# Altium schematic sheet CAp_STM.SchDoc
size A3; Author: Audran; CompanyName: Goldorak; Address1: Electrolab; Address2: 52 rue Paul Lescop; Address3: 92000 Nanterre; ProjectName: Cartes_2017
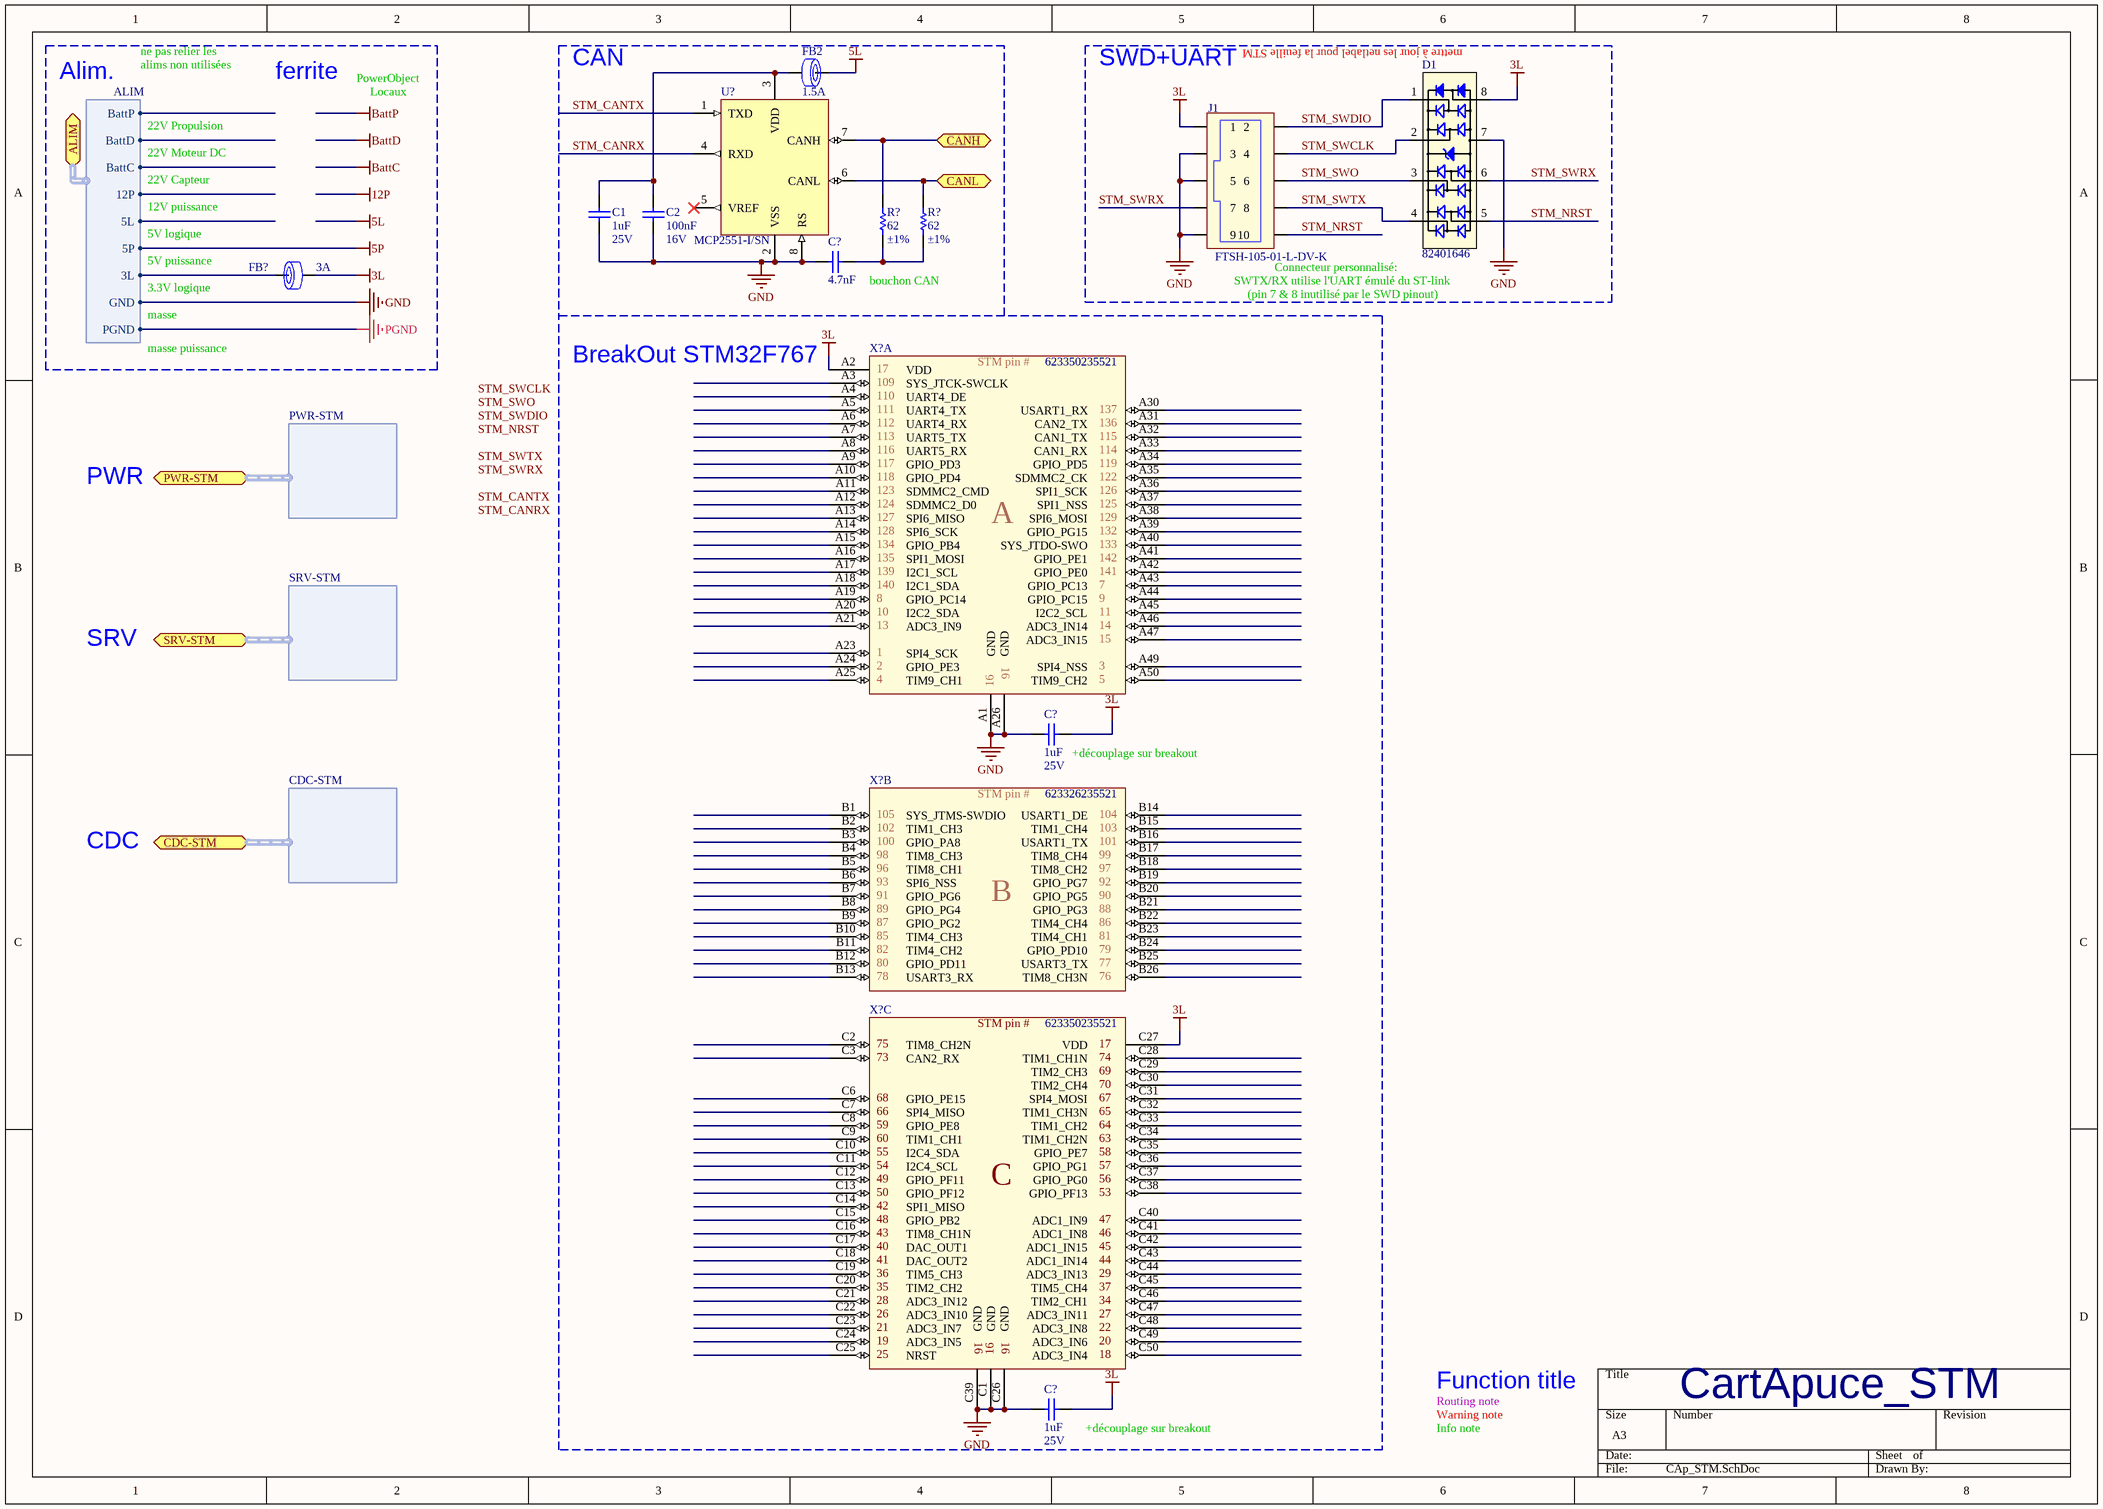
[diagram p0: CAp_STM.SchDoc]

## Parts
(Parts that share a designator on the sheet are numbered #1, #2 ... from top to bottom, then left to right.)
C1  1uF  RatedVoltage: 25V  [WCAP-CSGP_0603, 1.6x0.8x0.8]
C2  100nF  RatedVoltage: 16V  [WCAP-CSGP_0402, 1x0.5x0.5]
C?#1  4.7nF  [WCAP-CSGP_0402, 1x0.5x0.5]
C?#2  1uF  RatedVoltage: 25V  [WCAP-CSGP_0603, 1.6x0.8x0.8]
C?#3  1uF  RatedVoltage: 25V  [WCAP-CSGP_0603, 1.6x0.8x0.8]
D1  82401646  [MSOP-8L]
FB2  RatedCurrent: 1.5A  [WE-CBF_0603_High Current]  (hidden comment: 742792624)
FB?  RatedCurrent: 3A  [WE-CBF_0805_High Current]  (hidden comment: 742792023)
J1  FTSH-105-01-L-DV-K  [FTSH-105-01-L-DV-K]
R?#1  value 62  Precision: ±1%  [RESC1005X04N]  (hidden comment: RC0402FR-0762RL)
R?#2  value 62  Precision: ±1%  [RESC1005X04N]  (hidden comment: RC0402FR-0762RL)
U?  MCP2551-I/SN  [SO8_N]
X?#1  623326235521+2x 623350235521  (value not drawn)  (part A of 3)
X?#2  623326235521+2x 623350235521  (value not drawn)  (part B of 3)
X?#3  623326235521+2x 623350235521  (value not drawn)  (part C of 3)

## Blocks framed on the sheet
CAN: C1 C2 C?#1 FB2 R?#1 R?#2 U?
SWD+UART: D1 J1
BreakOut STM32F767: C?#2 C?#3 X?#1-X?#3

## Ports
ALIM (harness ALIM), CANH, CANL, CDC-STM (harness CDC-STM), PWR-STM (harness PWR-STM), SRV-STM (harness SRV-STM)

## Harnesses
PWR-STM: 
SRV-STM: 
CDC-STM: 
ALIM: BattP, BattD, BattC, 12P, 5L, 5P, 3L, GND, PGND

## Nets
3L: C?#2.1 C?#3.1 D1.8 FB?.2 J1.1 X?#1.A2(VDD) X?#3.C27(VDD)
5L: FB2.1
5P: port ALIM.5P
GND: C1.1 C2.1 C?#1.1 C?#2.2 C?#3.2 D1.7 J1.3 J1.5 J1.9 U?.2(VSS) U?.8(RS) X?#1.A1(GND) X?#1.A26(GND) X?#3.C1(GND) X?#3.C26(GND) X?#3.C39(GND) ; port ALIM.GND
PGND: port ALIM.PGND
CANH: R?#1.2 U?.7(CANH) ; port CANH
CANL: R?#2.2 U?.6(CANL) ; port CANL
STM_CANRX: U?.4(RXD)
STM_CANTX: U?.1(TXD)
STM_NRST: D1.5 J1.10
STM_SWCLK: D1.2 J1.4
STM_SWDIO: D1.1 J1.2
STM_SWO: D1.3 J1.6
STM_SWRX: D1.6 J1.7
STM_SWTX: D1.4 J1.8
NetC1_2: C1.2 C2.2 FB2.2 U?.3(VDD)
NetC?#1_2: C?#1.2 R?#1.1 R?#2.1
NetFB?_1: FB?.1 ; port ALIM.3L

Not connected (* = marked no-connect by the designer): U? 5(VREF)*; X?#1 A3(SYS_JTCK-SWCLK) A4(UART4_DE) A5(UART4_TX) A6(UART4_RX) A7(UART5_TX) A8(UART5_RX) A9(GPIO_PD3) A10(GPIO_PD4) A11(SDMMC2_CMD) A12(SDMMC2_D0) A13(SPI6_MISO) A14(SPI6_SCK) A15(GPIO_PB4) A16(SPI1_MOSI) A17(I2C1_SCL) A18(I2C1_SDA) A19(GPIO_PC14) A20(I2C2_SDA) A21(ADC3_IN9) A22(NC) A23(SPI4_SCK) A24(GPIO_PE3) A25(TIM9_CH1) A27(NC) A28(NC) A29(NC) A30(USART1_RX) A31(CAN2_TX) A32(CAN1_TX) A33(CAN1_RX) A34(GPIO_PD5) A35(SDMMC2_CK) A36(SPI1_SCK) A37(SPI1_NSS) A38(SPI6_MOSI) A39(GPIO_PG15) A40(SYS_JTDO-SWO) A41(GPIO_PE1) A42(GPIO_PE0) A43(GPIO_PC13) A44(GPIO_PC15) A45(I2C2_SCL) A46(ADC3_IN14) A47(ADC3_IN15) A48(NC) A49(SPI4_NSS) A50(TIM9_CH2); X?#2 B1(SYS_JTMS-SWDIO) B2(TIM1_CH3) B3(GPIO_PA8) B4(TIM8_CH3) B5(TIM8_CH1) B6(SPI6_NSS) B7(GPIO_PG6) B8(GPIO_PG4) B9(GPIO_PG2) B10(TIM4_CH3) B11(TIM4_CH2) B12(GPIO_PD11) B13(USART3_RX) B14(USART1_DE) B15(TIM1_CH4) B16(USART1_TX) B17(TIM8_CH4) B18(TIM8_CH2) B19(GPIO_PG7) B20(GPIO_PG5) B21(GPIO_PG3) B22(TIM4_CH4) B23(TIM4_CH1) B24(GPIO_PD10) B25(USART3_TX) B26(TIM8_CH3N); X?#3 C2(TIM8_CH2N) C3(CAN2_RX) C4(NC) C5(NC) C6(GPIO_PE15) C7(SPI4_MISO) C8(GPIO_PE8) C9(TIM1_CH1) C10(I2C4_SDA) C11(I2C4_SCL) C12(GPIO_PF11) C13(GPIO_PF12) C14(SPI1_MISO) C15(GPIO_PB2) C16(TIM8_CH1N) C17(DAC_OUT1) C18(DAC_OUT2) C19(TIM5_CH3) C20(TIM2_CH2) C21(ADC3_IN12) C22(ADC3_IN10) C23(ADC3_IN7) C24(ADC3_IN5) C25(NRST) C28(TIM1_CH1N) C29(TIM2_CH3) C30(TIM2_CH4) C31(SPI4_MOSI) C32(TIM1_CH3N) C33(TIM1_CH2) C34(TIM1_CH2N) C35(GPIO_PE7) C36(GPIO_PG1) C37(GPIO_PG0) C38(GPIO_PF13) C40(ADC1_IN9) C41(ADC1_IN8) C42(ADC1_IN15) C43(ADC1_IN14) C44(ADC3_IN13) C45(TIM5_CH4) C46(TIM2_CH1) C47(ADC3_IN11) C48(ADC3_IN8) C49(ADC3_IN6) C50(ADC3_IN4)

## Notes on the sheet
- (near D1) mettre à jour les netlabel pour la feuille STM
- Alim.
- ne pas relier les
- alims non utilisées
- ferrite
- PowerObject
- Locaux
- 22V Propulsion
- 22V Moteur DC
- 22V Capteur
- 5V logique
- 12V puissance
- 5V puissance
- 3.3V logique
- masse
- bouchon CAN
- SWTX/RX utilise l'UART émulé du ST-link
- (pin 7 & 8 inutilisé par le SWD pinout)
- Connecteur personnalisé:
- masse puissance
- PWR
- SRV
- (near C?#2) +découplage sur breakout
- CDC
- Function title
- (near C?#3) +découplage sur breakout
- Routing note
- Warning note
- Info note
- CartApuce_STM
- Labels drawn without touching a wire or pin: STM_CANRX, STM_CANTX, STM_NRST, STM_SWCLK, STM_SWDIO, STM_SWO, STM_SWRX, STM_SWTX
- (in symbol STM32F767_BreakOut2017, part A) STM pin #; 623350235521; 17; 109; 110; 111; 137; 112; 136; 113; 115; 116; 114; 117; 119; 118; 122; 123; 126; 124; 125; 127; 129; A; 128; 132; 134; 133; 135; 142; 139; 141; 140; 7; 8; 9; 10; 11; 13; 14; 15; 1; 16; 2; 3; 4; 5
- (in symbol STM32F767_BreakOut2017, part B) STM pin #; 623326235521; 105; 104; 102; 103; 100; 101; 98; 99; 96; 97; 93; 92; 91; 90; B; 89; 88; 87; 86; 85; 81; 82; 79; 80; 77; 78; 76
- (in symbol STM32F767_BreakOut2017, part C) STM pin #; 623350235521; 75; 17; 73; 74; 69; 70; 68; 67; 66; 65; 59; 64; 60; 63; 55; 58; 54; 57; 49; 56; C; 50; 53; 42; 48; 47; 43; 46; 40; 45; 41; 44; 36; 29; 35; 37; 28; 34; 26; 27; 21; 22; 16; 19; 20; 25; 18

## Library data of the parts
C1 C?#2 C?#3 = WCAP-CSGP, 885012206076: CAP CER 1uF 25V X7R 0603; Manufacturer: Wurth Elektronik; PublishedDate: Aug 2016; ComponentLink1Description: Manufacturer; ComponentLink1URL: http://www.we-online.de; ComponentLink2Description: Datasheet; ComponentLink2URL: http://katalog.we-online.com/pbs/datasheet/885012206076.pdf; Manufacturer Part Number: 885012206076; Value: 1uF; Size: 0603; CeramicType: X7R
C2 = WCAP-CSGP, 885012205037: CAP CER 100nF 16V X7R 0402; Manufacturer: Wurth Elektronik; PublishedDate: Aug 2016; ComponentLink1Description: Manufacturer; ComponentLink1URL: http://www.we-online.de; ComponentLink2Description: Datasheet; ComponentLink2URL: http://katalog.we-online.com/pbs/datasheet/885012205037.pdf; Value: 100nF; Size: 0402; CeramicType: X7R; Manufacturer Part Number: 885012205037
C?#1 = WCAP-CSGP, 885012205065: CAP CER 4.7nF 50V X7R 0402; Manufacturer: Wurth Elektronik; PublishedDate: Aug 2016; ComponentLink1Description: Manufacturer; ComponentLink1URL: http://www.we-online.de; ComponentLink2Description: Datasheet; ComponentLink2URL: http://katalog.we-online.com/pbs/datasheet/885012205065.pdf; Manufacturer Part Number: 885012205065; Value: 4.7nF; Size: 0402; CeramicType: X7R; RatedVoltage: 50V
D1 = 82401646: TVS DIODE 5VWM 13VC 8MSOP; Manufacturer: Wurth Electronics Inc.; Supplier 1: Farnell; Manufacturer Part Number: 82401646; ComponentLink1URL: http://katalog.we-online.de/pbs/datasheet/82401646.pdf; ComponentLink1Description: Datasheet; Supplier Part Number 1: 1825864
FB2 = WE-CBF, 742792624: Ferrite Bead 180ohm 0603 max1.5A; Manufacturer: Wurth Elektronik; Value: 180Ω; Type: High Current; PublishedDate: Aug 2016; ComponentLink1Description: Manufacturer; ComponentLink1URL: http://www.we-online.de; ComponentLink2Description: Datasheet; ComponentLink2URL: http://katalog.we-online.de/pbs/datasheet/742792624.pdf; Manufacturer Part Number: 742792624; Size: 0603
FB? = WE-CBF, 742792023: Ferrite Bead 120ohm 0805 max3.0A; Manufacturer: Wurth Elektronik; Value: 120Ω; Type: High Current; PublishedDate: Aug 2016; ComponentLink1Description: Manufacturer; ComponentLink1URL: http://www.we-online.de; ComponentLink2Description: Datasheet; ComponentLink2URL: http://katalog.we-online.de/pbs/datasheet/742792023.pdf; Manufacturer Part Number: 742792023; Size: 0805
J1 = FTSH-105-01-L-DV-K: CONN HEADER 10 POS DUAL .05" SMD with Keying; Manufacturer: Samtec Inc.; Supplier 1: Digi-Key; Manufacturer Part Number: FTSH-105-01-L-DV-K; ComponentLink1URL: http://suddendocs.samtec.com/prints/ftsh-1xx-xx-xxx-dv-xxx-xxx-mkt.pdf; ComponentLink1Description: Datasheet; Supplier Part Number 1: SAM8799-ND
R?#1 R?#2 = RC0402FR-0762RL: RES SMD 62 OHM 1% 1/16W 0402; Manufacturer: Yageo; Power: 63mW; Vmax: 50V; Type: Thick Film; ComponentLink1Description: Manufacturer; ComponentLink1URL: http://www.yageo.com/NewPortal/_en/index.jsp; ComponentLink2Description: Datasheet; ComponentLink2URL: http://www.farnell.com/datasheets/2167052.pdf; Manufacturer Part Number: RC0402FR-0762RL; Supplier 1: Farnell; Supplier Part Number 1: 1458813
U? = MCP2551-I/SN: IC TRANSCEIVER CAN HI-SPD 8-SOIC; Manufacturer: Microchip Technology; Manufacturer Part Number: MCP2551-I/SN; ComponentLink1Description: Datasheet; ComponentLink1URL: http://www.farnell.com/datasheets/657417.pdf; Supplier 1: Farnell; Supplier Part Number 1: 9758569
X?#1-X?#3 = STM32F767_BreakOut2017: BreakOut 2017 for STM32F767; Manufacturer: Wurth Electronics Inc.; ComponentLink1URL: https://github.com/goldobot/ELEC/tree/master/2-PROJ/4-BreakOut_2017; ComponentLink1Description: link to project on GitHub; Manufacturer Part Number: 623326235521+2x 623350235521